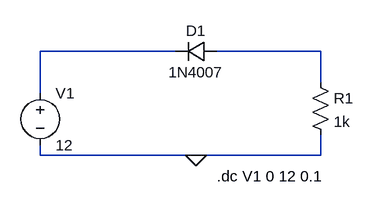
[diagram p0: schematic protection diode.asc]
protection diode.asc, the LTspice schematic file:
Version 4.1
SHEET 1 880 680
WIRE 352 48 144 48
WIRE 576 48 416 48
WIRE 576 96 576 48
WIRE 144 112 144 48
WIRE 144 208 144 192
WIRE 384 208 144 208
WIRE 576 208 576 176
WIRE 576 208 384 208
FLAG 384 208 0
SYMBOL voltage 144 96 R0
SYMATTR InstName V1
SYMATTR Value 12
SYMBOL diode 416 32 R90
WINDOW 0 0 32 VBottom 2
WINDOW 3 32 32 VTop 2
SYMATTR InstName D1
SYMATTR Value 1N4007
SYMBOL res 560 80 R0
SYMATTR InstName R1
SYMATTR Value 1k
TEXT 416 240 Left 2 !.dc V1 0 12 0.1

The netlist it stands for:
* protection diode.asc
V1 N001 0 12
D1 N002 N001 1N4007
R1 N002 0 1k
.model D D
.lib standard.dio
.dc V1 0 12 0.1
.backanno
.end